# Altium schematic sheet 02 BLOCK DIAGRAM.SchDoc: BLOCK DIAGRAM
size 420 x 297 mm; SheetNumber: 2; SheetTotal: 8
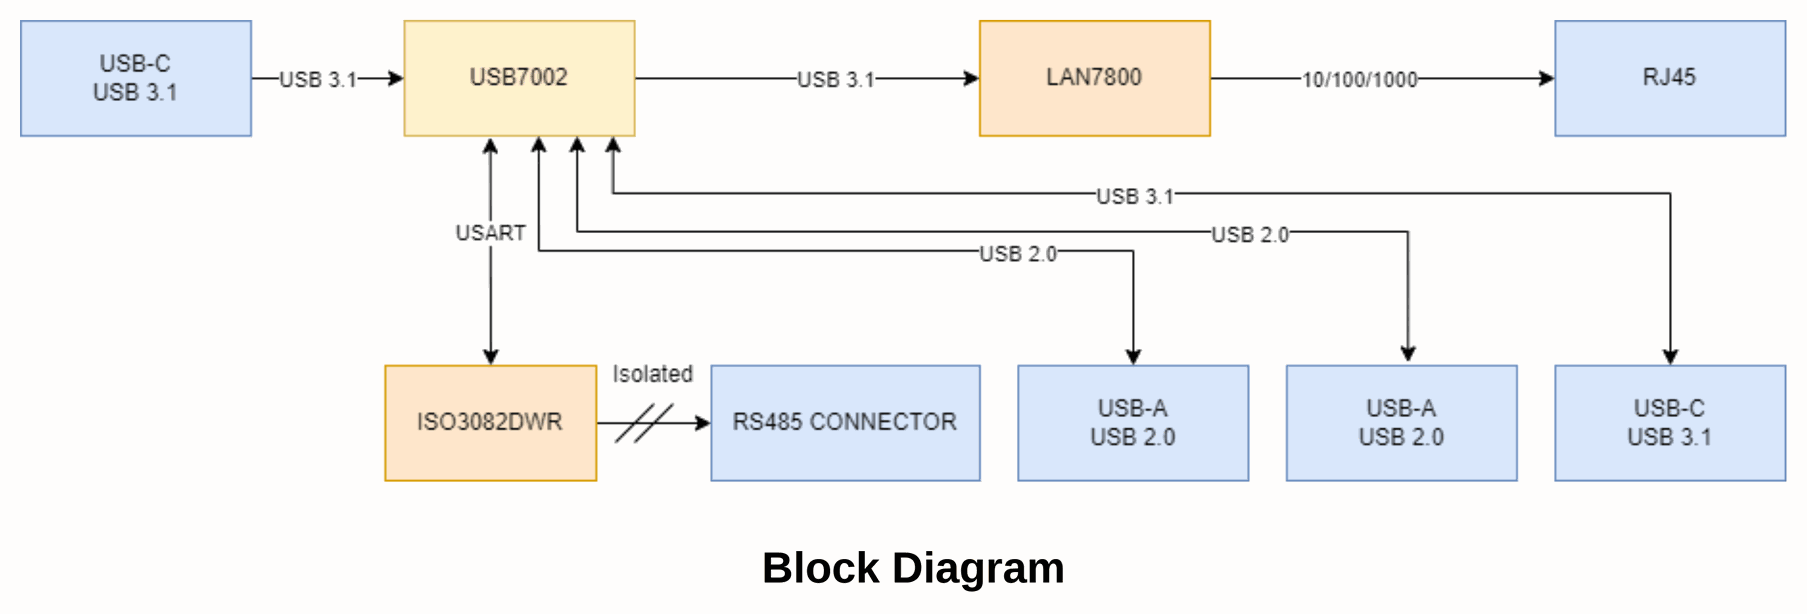
[diagram p0: 02 BLOCK DIAGRAM.SchDoc]

## Notes on the sheet
- Block Diagram
- Title
- Project
- Size
- Date
- Revision
- A3
- Designed By